# Altium schematic sheet F4中心板.SchDoc
size A4
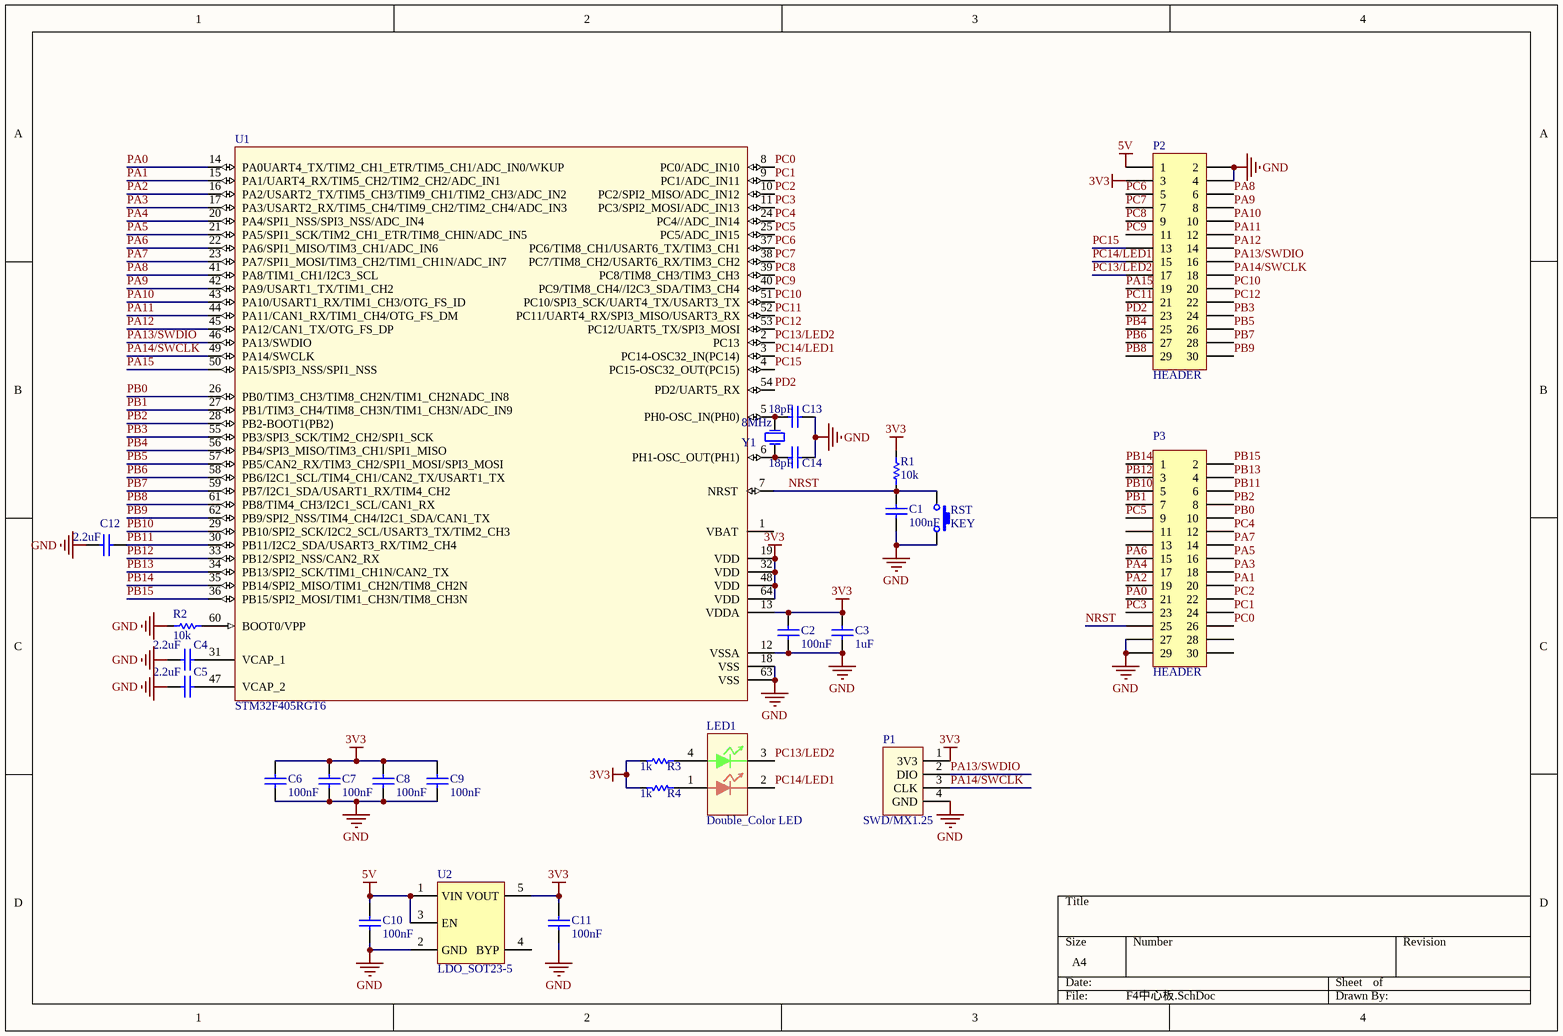
[diagram p0: F4中心板.SchDoc]

## Parts
C1  100nF  [0603C]
C2  100nF  [0603C]
C3  1uF  [0603C]
C4  2.2uF  [0603C]
C5  2.2uF  [0603C]
C6  100nF  [0603C]
C7  100nF  [0603C]
C8  100nF  [0603C]
C9  100nF  [0603C]
C10  100nF  [0603C]
C11  100nF  [0603C]
C12  2.2uF  [0603C]
C13  18pF  [0603C]
C14  18pF  [0603C]
LED1  Double_Color LED  [0805LEDX2]
P1  SWD/MX1.25  [A1.25AW-4P]
P2  HEADER  [HEADER 15x2 SMT 1.27MM]
P3  HEADER  [HEADER 15x2 SMT 1.27MM]
R1  10k  [0603R]
R2  10k  [0603R]
R3  1k  [0603R]
R4  1k  [0603R]
RST  KEY  [SW 3mmx4mm]
U1  STM32F405RGT6  [LQFP_64]
U2  LDO_SOT23-5  [SOT-23-5 L]
Y1  8MHz  [NX3225GD]

## Nets
3V3: C2.2 C3.2 C6.2 C7.2 C8.2 C9.2 C11.2 P1.1(3V3) P2.3 R1.2 R3.2 R4.1 U1.13(VDDA) U1.19(VDD) U1.32(VDD) U1.48(VDD) U1.64(VDD) U2.5(VOUT)
5V: C10.2 P2.1 U2.1(VIN) U2.3(EN)
GND: C1.1 C2.1 C3.1 C4.1 C5.1 C6.1 C7.1 C8.1 C9.1 C10.1 C11.1 C12.1 C13.1 C14.1 P1.4(GND) P2.2 P2.4 P3.27 P3.29 R2.1 RST.2 U1.12(VSSA) U1.18(VSS) U1.63(VSS) U2.2(GND)
NRST: C1.2 P3.25 R1.1 RST.1 U1.7(NRST)
PA0: P3.21 U1.14(PA0UART4_TX/TIM2_CH1_ETR/TIM5_CH1/ADC_IN0/WKUP)
PA1: P3.20 U1.15(PA1/UART4_RX/TIM5_CH2/TIM2_CH2/ADC_IN1)
PA2: P3.19 U1.16(PA2/USART2_TX/TIM5_CH3/TIM9_CH1/TIM2_CH3/ADC_IN2)
PA3: P3.18 U1.17(PA3/USART2_RX/TIM5_CH4/TIM9_CH2/TIM2_CH4/ADC_IN3)
PA4: P3.17 U1.20(PA4/SPI1_NSS/SPI3_NSS/ADC_IN4)
PA5: P3.16 U1.21(PA5/SPI1_SCK/TIM2_CH1_ETR/TIM8_CHIN/ADC_IN5)
PA6: P3.15 U1.22(PA6/SPI1_MISO/TIM3_CH1/ADC_IN6)
PA7: P3.14 U1.23(PA7/SPI1_MOSI/TIM3_CH2/TIM1_CH1N/ADC_IN7)
PA8: P2.6 U1.41(PA8/TIM1_CH1/I2C3_SCL)
PA9: P2.8 U1.42(PA9/USART1_TX/TIM1_CH2)
PA10: P2.10 U1.43(PA10/USART1_RX/TIM1_CH3/OTG_FS_ID)
PA11: P2.12 U1.44(PA11/CAN1_RX/TIM1_CH4/OTG_FS_DM)
PA12: P2.14 U1.45(PA12/CAN1_TX/OTG_FS_DP)
PA13/SWDIO: P1.2(DIO) P2.16 U1.46(PA13/SWDIO)
PA14/SWCLK: P1.3(CLK) P2.18 U1.49(PA14/SWCLK)
PA15: P2.19 U1.50(PA15/SPI3_NSS/SPI1_NSS)
PB0: P3.10 U1.26(PB0/TIM3_CH3/TIM8_CH2N/TIM1_CH2NADC_IN8)
PB1: P3.7 U1.27(PB1/TIM3_CH4/TIM8_CH3N/TIM1_CH3N/ADC_IN9)
PB2: P3.8 U1.28(PB2-BOOT1(PB2))
PB3: P2.24 U1.55(PB3/SPI3_SCK/TIM2_CH2/SPI1_SCK)
PB4: P2.25 U1.56(PB4/SPI3_MISO/TIM3_CH1/SPI1_MISO)
PB5: P2.26 U1.57(PB5/CAN2_RX/TIM3_CH2/SPI1_MOSI/SPI3_MOSI)
PB6: P2.27 U1.58(PB6/I2C1_SCL/TIM4_CH1/CAN2_TX/USART1_TX)
PB7: P2.28 U1.59(PB7/I2C1_SDA/USART1_RX/TIM4_CH2)
PB8: P2.29 U1.61(PB8/TIM4_CH3/I2C1_SCL/CAN1_RX)
PB9: P2.30 U1.62(PB9/SPI2_NSS/TIM4_CH4/I2C1_SDA/CAN1_TX)
PB10: P3.5 U1.29(PB10/SPI2_SCK/I2C2_SCL/USART3_TX/TIM2_CH3)
PB11: C12.2 P3.6 U1.30(PB11/I2C2_SDA/USART3_RX/TIM2_CH4)
PB12: P3.3 U1.33(PB12/SPI2_NSS/CAN2_RX)
PB13: P3.4 U1.34(PB13/SPI2_SCK/TIM1_CH1N/CAN2_TX)
PB14: P3.1 U1.35(PB14/SPI2_MISO/TIM1_CH2N/TIM8_CH2N)
PB15: P3.2 U1.36(PB15/SPI2_MOSI/TIM1_CH3N/TIM8_CH3N)
PC0: P3.26 U1.8(PC0/ADC_IN10)
PC1: P3.24 U1.9(PC1/ADC_IN11)
PC2: P3.22 U1.10(PC2/SPI2_MISO/ADC_IN12)
PC3: P3.23 U1.11(PC3/SPI2_MOSI/ADC_IN13)
PC4: P3.12 U1.24(PC4//ADC_IN14)
PC5: P3.9 U1.25(PC5/ADC_IN15)
PC6: P2.5 U1.37(PC6/TIM8_CH1/USART6_TX/TIM3_CH1)
PC7: P2.7 U1.38(PC7/TIM8_CH2/USART6_RX/TIM3_CH2)
PC8: P2.9 U1.39(PC8/TIM8_CH3/TIM3_CH3)
PC9: P2.11 U1.40(PC9/TIM8_CH4//I2C3_SDA/TIM3_CH4)
PC10: P2.20 U1.51(PC10/SPI3_SCK/UART4_TX/USART3_TX)
PC11: P2.21 U1.52(PC11/UART4_RX/SPI3_MISO/USART3_RX)
PC12: P2.22 U1.53(PC12/UART5_TX/SPI3_MOSI)
PC13/LED2: LED1.3 P2.17 U1.2(PC13)
PC14/LED1: LED1.2 P2.15 U1.3(PC14-OSC32_IN(PC14))
PC15: P2.13 U1.4(PC15-OSC32_OUT(PC15))
PD2: P2.23 U1.54(PD2/UART5_RX)
NetC4_2: C4.2 U1.31(VCAP_1)
NetC5_2: C5.2 U1.47(VCAP_2)
NetC13_2: C13.2 U1.5(PH0-OSC_IN(PH0)) Y1.2(OSC2)
NetC14_2: C14.2 U1.6(PH1-OSC_OUT(PH1)) Y1.1(OSC1)
NetLED1_1: LED1.1 R4.2
NetLED1_4: LED1.4 R3.1
NetR2_2: R2.2 U1.60(BOOT0/VPP)

Not connected (* = marked no-connect by the designer): P3 11 13 28 30; U1 1(VBAT); U2 4(BYP)

## Library data of the parts
C1-C14 = Cap: Capacitor; Value: 100pF; Published: 8-Jun-2000; LatestRevisionDate: 17-Jul-2002; LatestRevisionNote: Re-released for DXP Platform.; PackageReference: RAD-0.3; Publisher: Altium Limited; PackageDescription: Radial Cap, Thru-Hole; 2 Leads; 0.3 in Pin Spacing
P1 = SWD_HEADER
P2 P3 = HEADER 15x2: 15X2 header
R1 R2 = Res1: Resistor; Value: 1K; Published: 8-Jun-2000; LatestRevisionDate: 17-Jul-2002; LatestRevisionNote: Re-released for DXP Platform.; PackageReference: AXIAL-0.3; Publisher: Altium Limited; PackageDescription: Axial Device, Thru-Hole; 2 Leads; 0.3 in Pin Spacing
R3 R4 = Res1: Resistor; Published: 8-Jun-2000; LatestRevisionDate: 17-Jul-2002; LatestRevisionNote: Re-released for DXP Platform.; PackageReference: AXIAL-0.3; Publisher: Altium Limited; PackageDescription: Axial Device, Thru-Hole; 2 Leads; 0.3 in Pin Spacing; Value: 1K
RST = PushButton_2p: Button; Published: 24-Mar-1999; LatestRevisionDate: 17-Jul-2002; LatestRevisionNote: Re-released for DXP Platform.; PackageReference: SPST-2; Publisher: Altium Limited; PackageDescription: Switch; 2 Leads
U1 = STM32F405RGT6_detail_1: ARM Cortex-M4 32b MCU+FPU, 210DMIP, 1024 kB Flash, 192+4 kB RAM, 51 I/Os, 64-pin LQFP, -40 to +85癈, Tray; Internal RAM: 192kB; Operating Frequency (Processor Speed): 168MHz; A/D Converter: 16x12-bit; D/A Converter: 2x12-bit; 16-bit Timers (IC/OC/PWM): 12x16-bit(24/24/30); 32-bit Timer (IC/OC/PWM): 2x32-bit (8/8/8); Other Timer Functions: 2xWDG, RTC, 24-bit down counter; Serial Interface: 3xSPI/2xI2S/2xI2C/3xUSART(IrDa, ISO7816)/3xUART/1xUSB OTG FS/HS, 2xCAN/ SDIO; DatasheetVersion: rev2, Jan-2012; PackageVersion: 2012; PackageReference: TQFP64; PackageDescription: 64-Pin Low Profile Quad Flat Package, 10x10 mm Body, 0.5 mm Pitch; ComponentLink1Description: Manufacturer URL; ComponentLink1URL: http://www.st.com/; ComponentLink2Description: STM32F405/7 Datasheet; ComponentLink2URL: http://www.st.com/internet/com/TECHNICAL_RESOURCES/TECHNICAL_LITERATURE/DATASHEET/DM00037051.pdf; ComponentLink3Description: STM32F4 Web Page; ComponentLink3URL: http://www.st.com/internet/mcu/subclass/1521.jsp
Y1 = XTAL: Crystal Oscillator; Published: 8-Jun-2000; LatestRevisionDate: 17-Jul-2002; LatestRevisionNote: Re-released for DXP Platform.; PackageReference: R38; Publisher: Altium Limited; PackageDescription: Crystal, Thru-Hole; 2 Leads; Body 3.1 x 8.2 mm (Dia.xH)